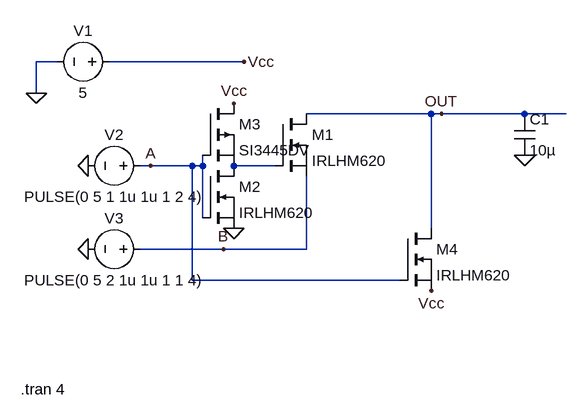
[diagram p0: schematic OR PTL.asc]
OR PTL.asc, the LTspice schematic file:
Version 4.1
SHEET 1 880 680
WIRE -128 -16 -160 -16
WIRE 160 -16 -48 -16
WIRE -160 32 -160 -16
WIRE 448 64 256 64
WIRE 464 64 448 64
WIRE 592 64 464 64
WIRE 656 64 592 64
WIRE 16 144 0 144
WIRE 80 144 16 144
WIRE 96 144 96 128
WIRE 96 144 80 144
WIRE 208 144 144 144
WIRE 96 224 96 144
WIRE 448 240 448 64
WIRE 128 272 0 272
WIRE 256 272 256 160
WIRE 256 272 128 272
WIRE 80 320 80 144
WIRE 400 320 80 320
FLAG -160 32 0
FLAG 160 -16 Vcc
FLAG -80 144 0
FLAG -80 272 0
FLAG 144 48 Vcc
FLAG 144 240 0
FLAG 16 144 A
FLAG 128 272 B
FLAG 464 64 OUT
FLAG 448 336 Vcc
FLAG 592 128 0
SYMBOL voltage -32 -16 R90
WINDOW 0 -32 56 VBottom 2
WINDOW 3 32 56 VTop 2
WINDOW 123 0 0 Left 0
WINDOW 39 0 0 Left 0
SYMATTR InstName V1
SYMATTR Value 5
SYMBOL voltage 16 144 R90
WINDOW 0 -32 56 VBottom 2
WINDOW 3 32 56 VTop 2
WINDOW 123 0 0 Left 0
WINDOW 39 0 0 Left 0
SYMATTR InstName V2
SYMATTR Value PULSE(0 5 1 1u 1u 1 2 4)
SYMBOL voltage 16 272 R90
WINDOW 0 -32 56 VBottom 2
WINDOW 3 32 56 VTop 2
WINDOW 123 0 0 Left 0
WINDOW 39 0 0 Left 0
SYMATTR InstName V3
SYMATTR Value PULSE(0 5 2 1u 1u 1 1 4)
SYMBOL nmos 208 64 R0
SYMATTR InstName M1
SYMATTR Value IRLHM620
SYMBOL pmos 96 48 R0
SYMATTR InstName M3
SYMATTR Value SI3445DV
SYMBOL nmos 96 144 R0
SYMATTR InstName M2
SYMATTR Value IRLHM620
SYMBOL nmos 400 240 R0
SYMATTR InstName M4
SYMATTR Value IRLHM620
SYMBOL cap 576 64 R0
SYMATTR InstName C1
SYMATTR Value 10µ
TEXT -184 488 Left 2 !.tran 4

The netlist it stands for:
* OR PTL.asc
V1 Vcc 0 5
V2 A 0 PULSE(0 5 1 1u 1u 1 2 4)
V3 B 0 PULSE(0 5 2 1u 1u 1 1 4)
M1 OUT N001 B B IRLHM620
M3 Vcc A N001 N001 SI3445DV
M2 N001 A 0 0 IRLHM620
M4 OUT A Vcc Vcc IRLHM620
C1 OUT 0 10µ
.model NMOS NMOS
.model PMOS PMOS
.lib standard.mos
.tran 4
.backanno
.end